# Altium schematic sheet DriverBoard_CAN.SchDoc: Kapitoshka
size 594 x 420 mm; ApprovedBy: Алексеев; CheckedBy: Алексеев; DrawnBy: Подлесный; DocumentNumber: СКТБ.280317.002 Э3; SheetNumber: 1; Format: A2; DocumentType: Схема электрическая принципиальная; ImagePath: Введите номер платы
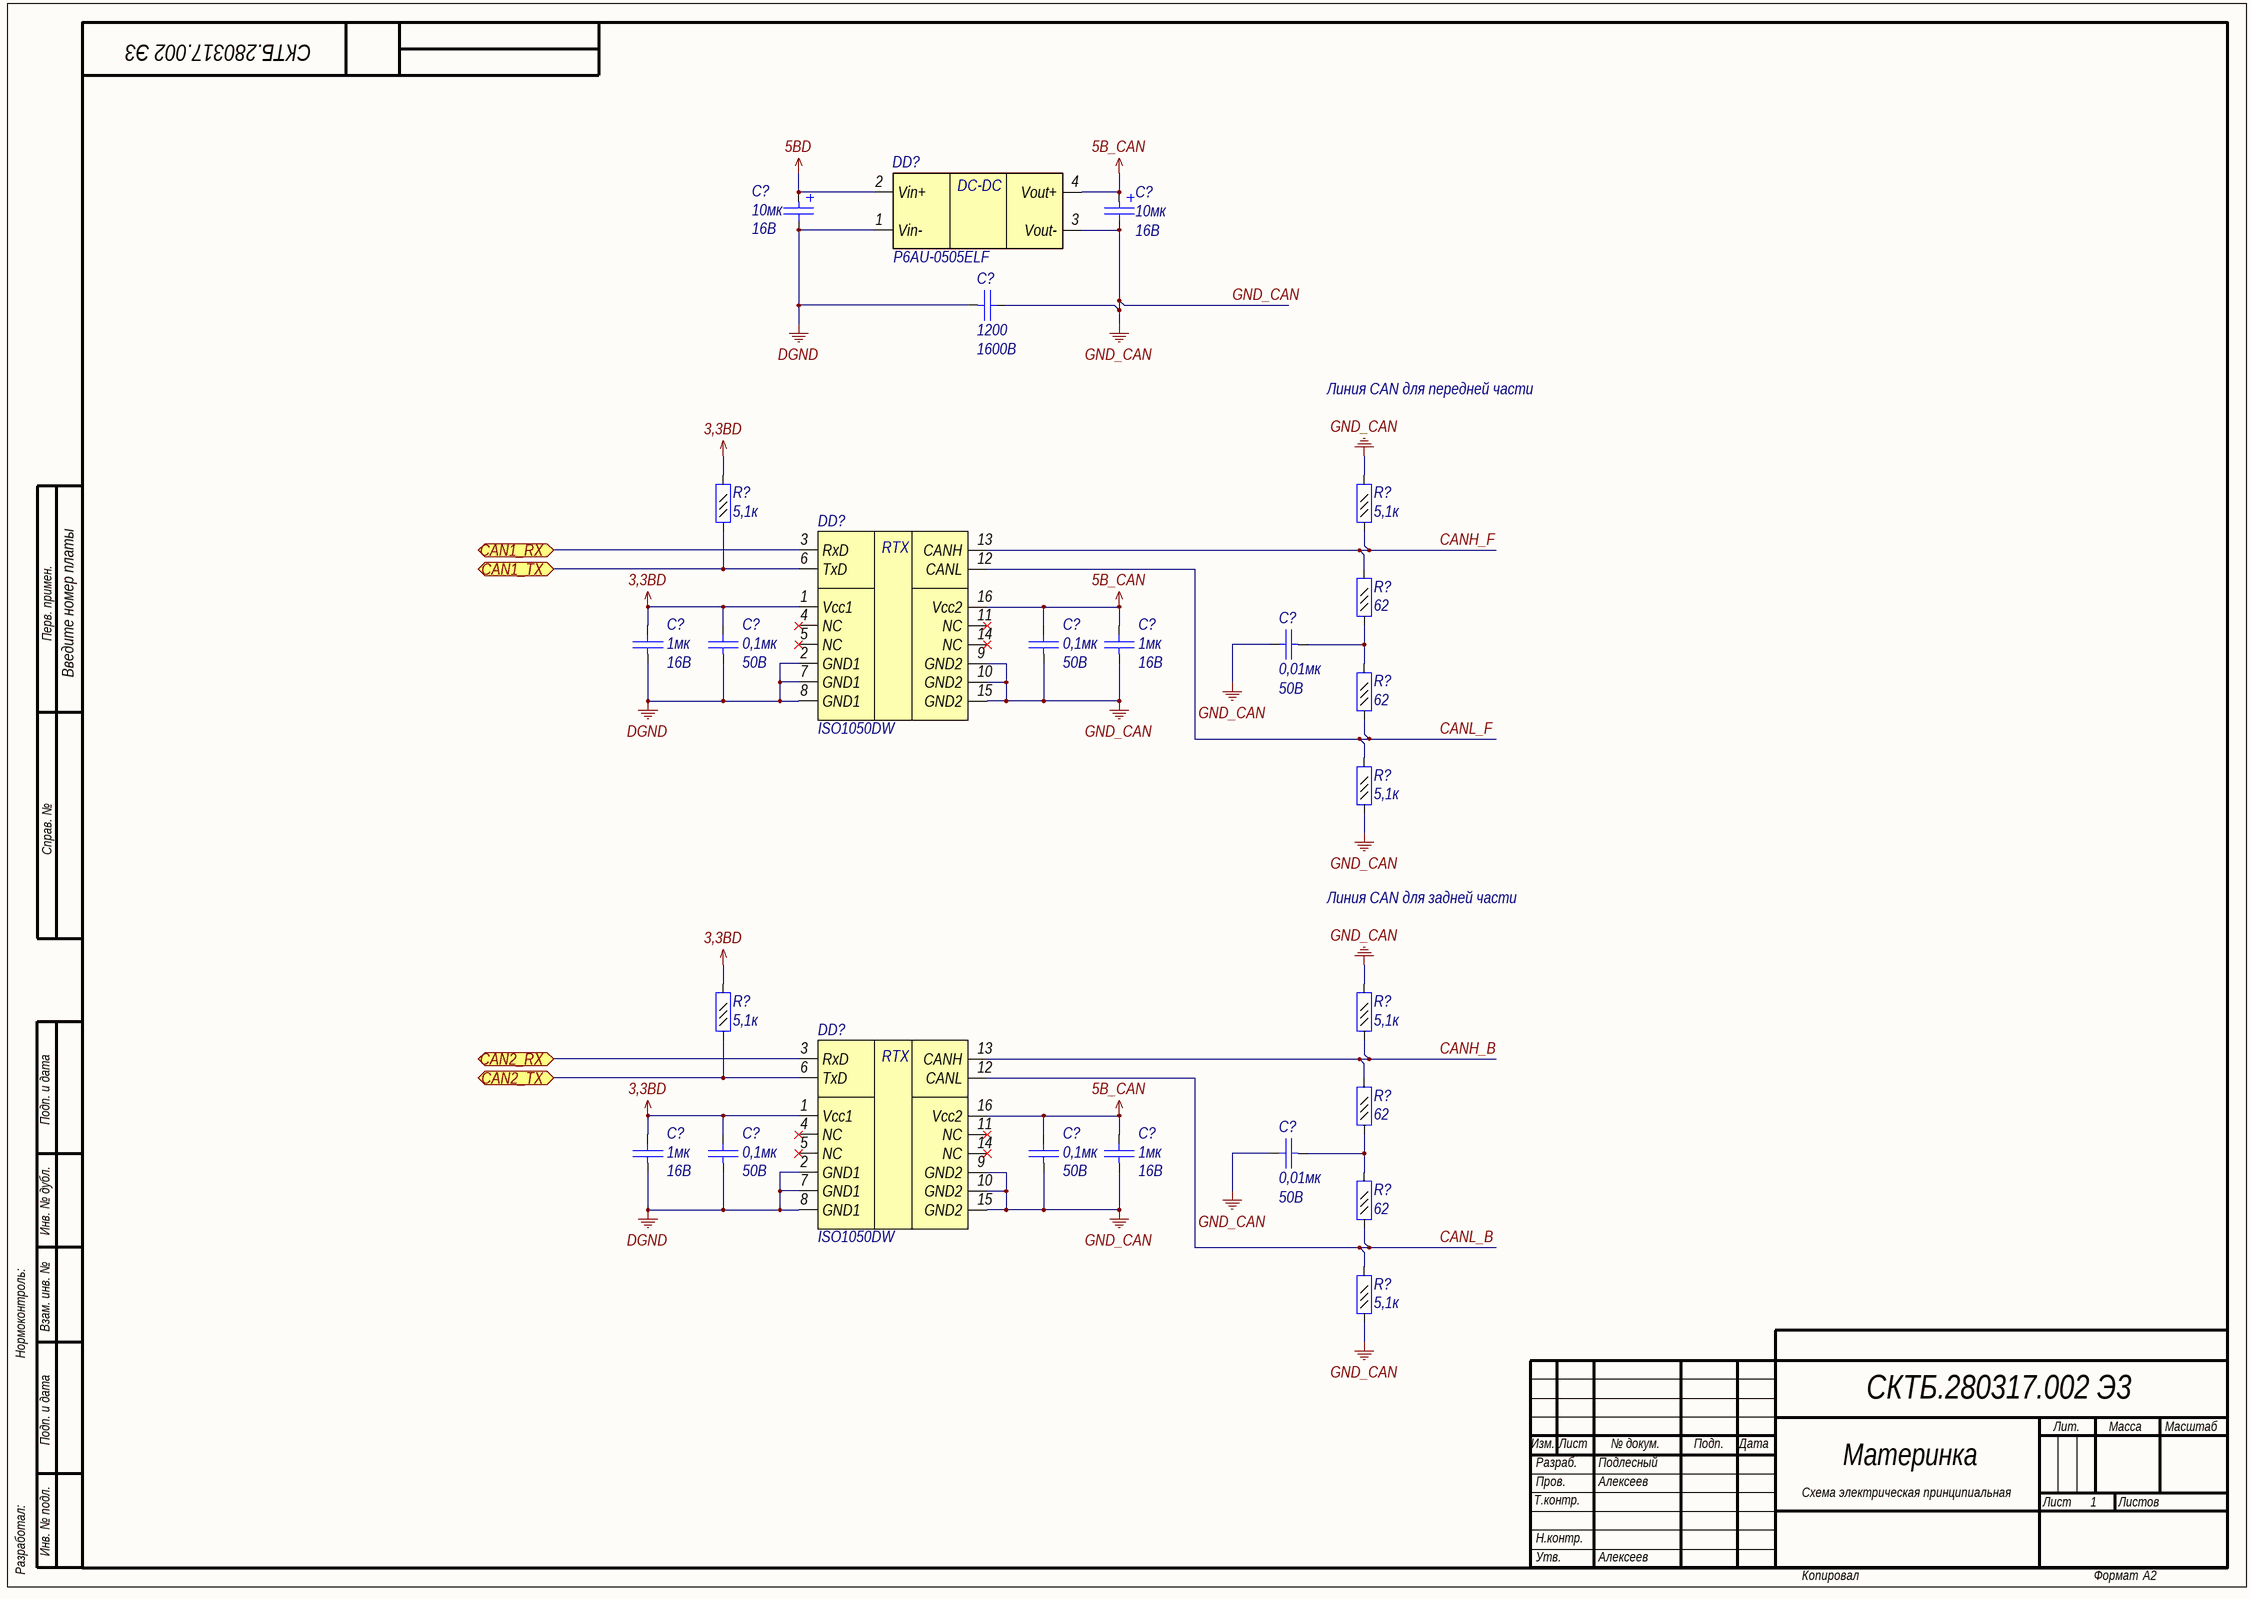
[diagram p0: DriverBoard_CAN.SchDoc]

## Parts
(Parts that share a designator on the sheet are numbered #1, #2 ... from top to bottom, then left to right.)
C?#1  value 10мк  Voltage: 16В  [TANTAL CASE A]  (hidden comment: Capacitor_pol)
C?#2  value 10мк  Voltage: 16В  [TANTAL CASE A]  (hidden comment: Capacitor_pol)
C?#3  value 1200  Voltage: 1600B  [K78-2]  (hidden comment: Capacitor)
C?#4  value 0,01мк  Voltage: 50B  [C0603]  (hidden comment: Capacitor)
C?#5  value 1мк  Voltage: 16B  [C0603]  (hidden comment: Capacitor)
C?#6  value 0,1мк  Voltage: 50B  [C0603]  (hidden comment: Capacitor)
C?#7  value 0,1мк  Voltage: 50B  [C0603]  (hidden comment: Capacitor)
C?#8  value 1мк  Voltage: 16B  [C0603]  (hidden comment: Capacitor)
C?#9  value 0,01мк  Voltage: 50B  [C0603]  (hidden comment: Capacitor)
C?#10  value 1мк  Voltage: 16B  [C0603]  (hidden comment: Capacitor)
C?#11  value 0,1мк  Voltage: 50B  [C0603]  (hidden comment: Capacitor)
C?#12  value 0,1мк  Voltage: 50B  [C0603]  (hidden comment: Capacitor)
C?#13  value 1мк  Voltage: 16B  [C0603]  (hidden comment: Capacitor)
DD?#1  Part Number: P6AU-0505ELF  [SIP4]  (hidden comment: P6AU-xxxxELF)
DD?#2  (no value)  [SO16]
DD?#3  (no value)  [SO16]
R?#1  value 5,1к  [R0603]  (hidden comment: Resistor_0,062Вт)
R?#2  value 5,1к  [R0603]  (hidden comment: Resistor_0,062Вт)
R?#3  value 62  [R0603]  (hidden comment: Resistor_0,062Вт)
R?#4  value 62  [R0603]  (hidden comment: Resistor_0,062Вт)
R?#5  value 5,1к  [R0603]  (hidden comment: Resistor_0,062Вт)
R?#6  value 5,1к  [R0603]  (hidden comment: Resistor_0,062Вт)
R?#7  value 5,1к  [R0603]  (hidden comment: Resistor_0,062Вт)
R?#8  value 62  [R0603]  (hidden comment: Resistor_0,062Вт)
R?#9  value 62  [R0603]  (hidden comment: Resistor_0,062Вт)
R?#10  value 5,1к  [R0603]  (hidden comment: Resistor_0,062Вт)

## Ports
CAN1_RX, CAN1_TX, CAN2_RX, CAN2_TX

## Nets
3,3BD: C?#5.2 C?#6.2 C?#10.2 C?#11.2 DD?#2.1(Vcc1) DD?#3.1(Vcc1) R?#1.2 R?#6.2
5B_CAN: C?#2.1 C?#7.2 C?#8.2 C?#12.2 C?#13.2 DD?#1.4(Vout+) DD?#2.16(Vcc2) DD?#3.16(Vcc2)
5BD: C?#1.1 DD?#1.2(Vin+)
DGND: C?#1.2 C?#3.1 C?#5.1 C?#6.1 C?#10.1 C?#11.1 DD?#1.1(Vin-) DD?#2.2(GND1) DD?#2.7(GND1) DD?#2.8(GND1) DD?#3.2(GND1) DD?#3.7(GND1) DD?#3.8(GND1)
GND_CAN: C?#2.2 C?#3.2 C?#4.2 C?#7.1 C?#8.1 C?#9.2 C?#12.1 C?#13.1 DD?#1.3(Vout-) DD?#2.9(GND2) DD?#2.10(GND2) DD?#2.15(GND2) DD?#3.9(GND2) DD?#3.10(GND2) DD?#3.15(GND2) R?#2.2 R?#5.1 R?#7.2 R?#10.1
CAN1_RX: DD?#2.3(RxD) ; port CAN1_RX
CAN1_TX: DD?#2.6(TxD) R?#1.1 ; port CAN1_TX
CAN2_RX: DD?#3.3(RxD) ; port CAN2_RX
CAN2_TX: DD?#3.6(TxD) R?#6.1 ; port CAN2_TX
CANH_B: DD?#3.13(CANH) R?#7.1 R?#8.2
CANH_F: DD?#2.13(CANH) R?#2.1 R?#3.2
CANL_B: DD?#3.12(CANL) R?#9.1 R?#10.2
CANL_F: DD?#2.12(CANL) R?#4.1 R?#5.2
NetC?#4_1: C?#4.1 R?#3.1 R?#4.2
NetC?#9_1: C?#9.1 R?#8.1 R?#9.2

Not connected (* = marked no-connect by the designer): DD?#2 4(NC)* 5(NC)* 11(NC)* 14(NC)*; DD?#3 4(NC)* 5(NC)* 11(NC)* 14(NC)*

## Notes on the sheet
- Линия CAN для передней части
- Перв. примен.
- Справ. №
- Линия CAN для задней части
- Подп. и дата
- Инв. № дубл.
- Нормоконтроль:
- Взам. инв. №
- Изм.
- Лист
- № докум.
- Подп.
- Дата
- Лит.
- Масса
- Масштаб
- Т.контр.
- Пров.
- Разраб.
- Материнка
- Листов
- Разработал:
- Инв. № подл.
- Н.контр.
- Утв.
- Копировал
- Формат
- (in symbol interf22) RTX
- (in symbol pwr52) DC-DC

## Library data of the parts
C?#1 C?#2 = cap199: Конденсатор полярный; Part Name: Tantal; Manufacture: Vishay; Part Number: 293D106X9016A2TE3; id: cap199
C?#3 = cap276: Конденсатор; Part Name: Film; Manufacture: Россия; Part Number: К78-2-1200пФ-1600В,10%; id: cap276; tga: 0,10%
C?#4 C?#9 = cap124: Конденсатор; Part Name: Ceramic; Manufacture: Murata; Part Number: GRM188R71H103K; id: cap124; TKE: X7R
C?#5 C?#8 C?#10 C?#13 = cap133: Конденсатор; Part Name: Ceramic; Manufacture: Murata; Part Number: GRM188R71C105KA12D**; id: cap133; TKE: X7R
C?#6 C?#7 C?#11 C?#12 = cap131: Конденсатор; Part Name: Ceramic; Manufacture: Murata; Part Number: GRM188R71H104KA93D; id: cap131; TKE: X7R
DD?#1 = pwr52: DC/DC преобразователь; Part Name: DC/DC Converter Isolated; Manufacturer: PEAK Electronics; id: pwr52; Input Voltage: 5B; Current: 200mA; Type: Isolated; Output Voltage: 5B
DD?#2 DD?#3 = interf22: Isolated CAN Transceiver; Manufacture: Texas Instruments; Number of Channel: 1; Type Supply: Single Polar; Current Consumption: 76mA; Power Supply: 3-5,5В/4,75-5,25В; id: interf22; Part Name: Isolated CAN Transceiver; Part Number: ISO1050DW
R?#1 R?#2 R?#5-R?#7 R?#10 = res480: Резистор; Manufacture: Yageo; Part Number: RC0603FR-075K1; id: res480; Accuracy: 0,01; Part Name: Resistor; Power: 0,062Вт
R?#3 R?#4 R?#8 R?#9 = res434: Резистор; Manufacture: Yageo; Part Number: RC0603FR-0762RL; id: res434; Accuracy: 0,01; Part Name: Resistor; Power: 0,062Вт